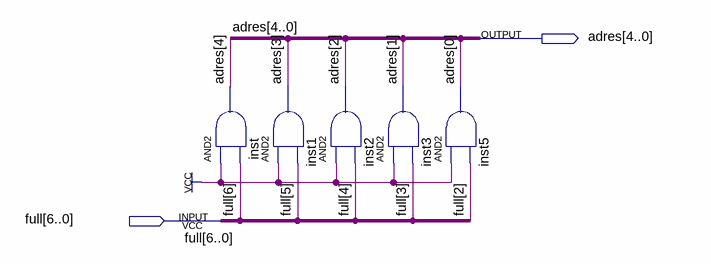
[diagram p0: schematic sheet]
// Quartus schematic adapterAdresForRAM.bdf as structural Verilog: 5 symbols, 2 pins
module adapterAdresForRAM (
  input  [6:0] full,
  output [4:0] adres
);

  and inst (adres[4], 1'b1, full[6]);
  and inst1 (adres[3], 1'b1, full[5]);
  and inst2 (adres[2], 1'b1, full[4]);
  and inst3 (adres[1], 1'b1, full[3]);
  and inst5 (adres[0], 1'b1, full[2]);
endmodule
